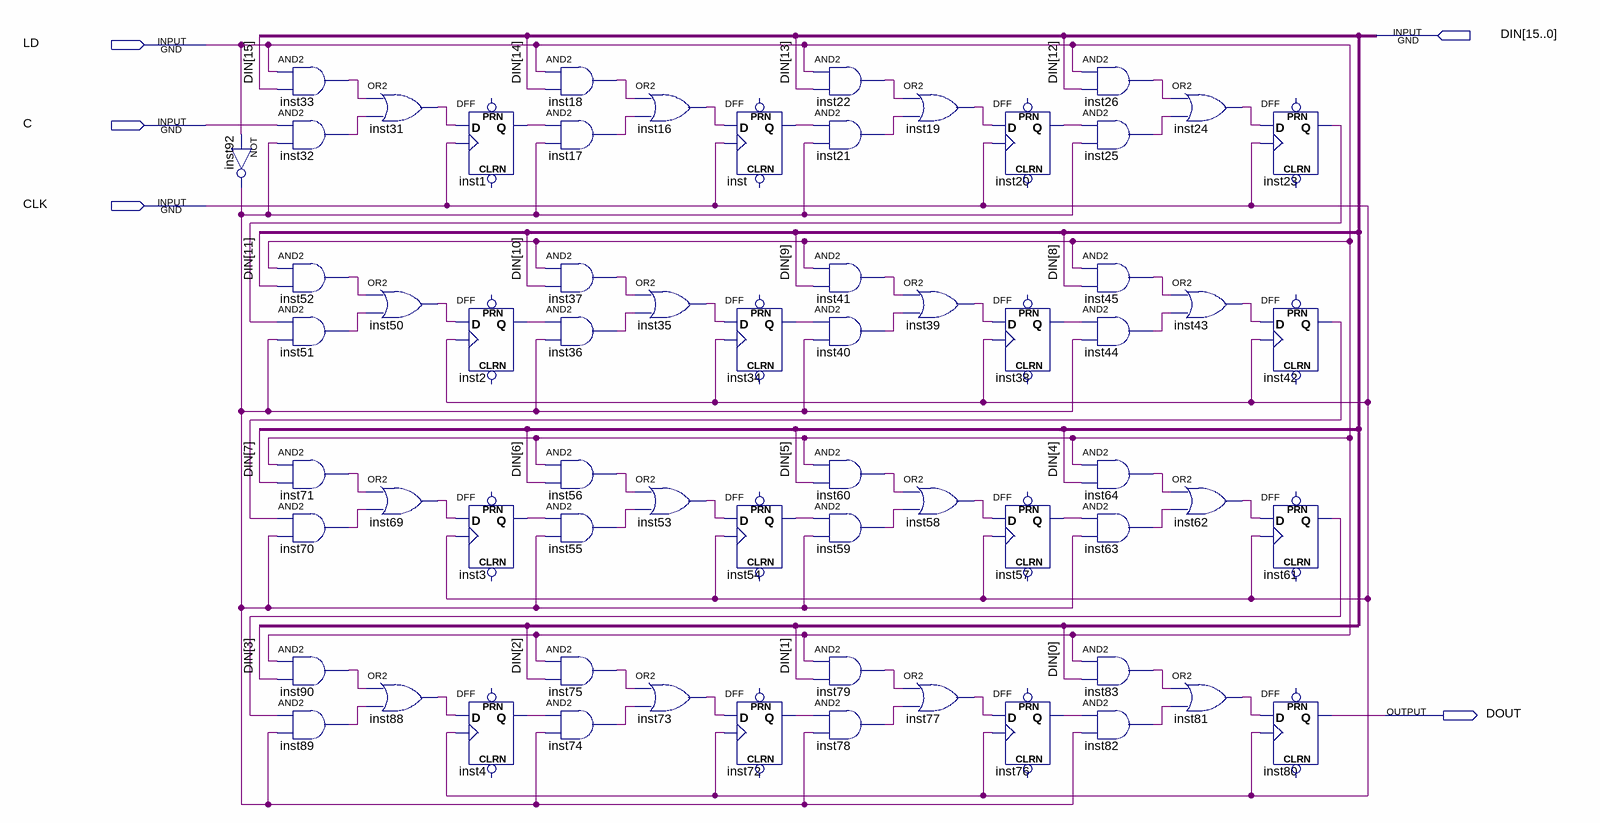
[diagram p0: schematic sheet]
// Quartus schematic serial_buffer.bdf as structural Verilog: 65 symbols, 5 pins
module serial_buffer (
  input  [15:0] DIN,
  input  LD,
  input  C,
  input  CLK,
  output DOUT
);

  wire inst1_q, inst2_q, inst3_q, inst4_q, inst16_out, inst17_out, inst18_out, inst19_out, inst20_q,
       inst21_out, inst22_out, inst23_q, inst24_out, inst25_out, inst26_out, inst31_out, inst32_out,
       inst33_out, inst34_q, inst35_out, inst36_out, inst37_out, inst38_q, inst39_out, inst40_out,
       inst41_out, inst42_q, inst43_out, inst44_out, inst45_out, inst50_out, inst51_out, inst52_out,
       inst53_out, inst54_q, inst55_out, inst56_out, inst57_q, inst58_out, inst59_out, inst60_out, inst61_q,
       inst62_out, inst63_out, inst64_out, inst69_out, inst70_out, inst71_out, inst72_q, inst73_out,
       inst74_out, inst75_out, inst76_q, inst77_out, inst78_out, inst79_out, inst81_out, inst82_out,
       inst83_out, inst88_out, inst89_out, inst90_out, inst92_out, inst_q;

  not inst92 (inst92_out, LD);
  and inst33 (inst33_out, LD, DIN[15]);
  and inst32 (inst32_out, C, inst92_out);
  and inst52 (inst52_out, LD, DIN[11]);
  and inst51 (inst51_out, inst23_q, inst92_out);
  and inst71 (inst71_out, LD, DIN[7]);
  and inst70 (inst70_out, inst42_q, inst92_out);
  and inst90 (inst90_out, LD, DIN[3]);
  and inst89 (inst89_out, inst61_q, inst92_out);
  or inst31 (inst31_out, inst33_out, inst32_out);
  or inst50 (inst50_out, inst52_out, inst51_out);
  or inst69 (inst69_out, inst71_out, inst70_out);
  or inst88 (inst88_out, inst90_out, inst89_out);
  DFF inst1 (.CLK(CLK), .D(inst31_out), .Q(inst1_q));  // open: CLRN, PRN
  DFF inst2 (.CLK(CLK), .D(inst50_out), .Q(inst2_q));  // open: CLRN, PRN
  DFF inst3 (.CLK(CLK), .D(inst69_out), .Q(inst3_q));  // open: CLRN, PRN
  DFF inst4 (.CLK(CLK), .D(inst88_out), .Q(inst4_q));  // open: CLRN, PRN
  and inst18 (inst18_out, LD, DIN[14]);
  and inst17 (inst17_out, inst1_q, inst92_out);
  and inst37 (inst37_out, LD, DIN[10]);
  and inst36 (inst36_out, inst2_q, inst92_out);
  and inst56 (inst56_out, LD, DIN[6]);
  and inst55 (inst55_out, inst3_q, inst92_out);
  and inst75 (inst75_out, LD, DIN[2]);
  and inst74 (inst74_out, inst4_q, inst92_out);
  or inst16 (inst16_out, inst18_out, inst17_out);
  or inst35 (inst35_out, inst37_out, inst36_out);
  or inst53 (inst53_out, inst56_out, inst55_out);
  or inst73 (inst73_out, inst75_out, inst74_out);
  DFF inst (.CLK(CLK), .D(inst16_out), .Q(inst_q));  // open: CLRN, PRN
  DFF inst34 (.CLK(CLK), .D(inst35_out), .Q(inst34_q));  // open: CLRN, PRN
  DFF inst54 (.CLK(CLK), .D(inst53_out), .Q(inst54_q));  // open: CLRN, PRN
  DFF inst72 (.CLK(CLK), .D(inst73_out), .Q(inst72_q));  // open: CLRN, PRN
  and inst22 (inst22_out, LD, DIN[13]);
  and inst21 (inst21_out, inst_q, inst92_out);
  and inst41 (inst41_out, LD, DIN[9]);
  and inst40 (inst40_out, inst34_q, inst92_out);
  and inst60 (inst60_out, LD, DIN[5]);
  and inst59 (inst59_out, inst54_q, inst92_out);
  and inst79 (inst79_out, LD, DIN[1]);
  and inst78 (inst78_out, inst72_q, inst92_out);
  or inst19 (inst19_out, inst22_out, inst21_out);
  or inst39 (inst39_out, inst41_out, inst40_out);
  or inst58 (inst58_out, inst60_out, inst59_out);
  or inst77 (inst77_out, inst79_out, inst78_out);
  DFF inst20 (.CLK(CLK), .D(inst19_out), .Q(inst20_q));  // open: CLRN, PRN
  DFF inst38 (.CLK(CLK), .D(inst39_out), .Q(inst38_q));  // open: CLRN, PRN
  DFF inst57 (.CLK(CLK), .D(inst58_out), .Q(inst57_q));  // open: CLRN, PRN
  DFF inst76 (.CLK(CLK), .D(inst77_out), .Q(inst76_q));  // open: CLRN, PRN
  and inst26 (inst26_out, LD, DIN[12]);
  and inst25 (inst25_out, inst20_q, inst92_out);
  and inst45 (inst45_out, LD, DIN[8]);
  and inst44 (inst44_out, inst38_q, inst92_out);
  and inst64 (inst64_out, LD, DIN[4]);
  and inst63 (inst63_out, inst57_q, inst92_out);
  and inst83 (inst83_out, LD, DIN[0]);
  and inst82 (inst82_out, inst76_q, inst92_out);
  or inst24 (inst24_out, inst26_out, inst25_out);
  or inst43 (inst43_out, inst45_out, inst44_out);
  or inst62 (inst62_out, inst64_out, inst63_out);
  or inst81 (inst81_out, inst83_out, inst82_out);
  DFF inst23 (.CLK(CLK), .D(inst24_out), .Q(inst23_q));  // open: CLRN, PRN
  DFF inst42 (.CLK(CLK), .D(inst43_out), .Q(inst42_q));  // open: CLRN, PRN
  DFF inst61 (.CLK(CLK), .D(inst62_out), .Q(inst61_q));  // open: CLRN, PRN
  DFF inst80 (.CLK(CLK), .D(inst81_out), .Q(DOUT));  // open: CLRN, PRN
endmodule
